# EasyEDA schematic SCH_DRS2_TH_2023-11-22.json
TITLE: Sheet_1; REV: 1.0; Date: 2022-11-13; Sheet: 1/1; Drawn By: MatthiasThiele; Company: Your Company
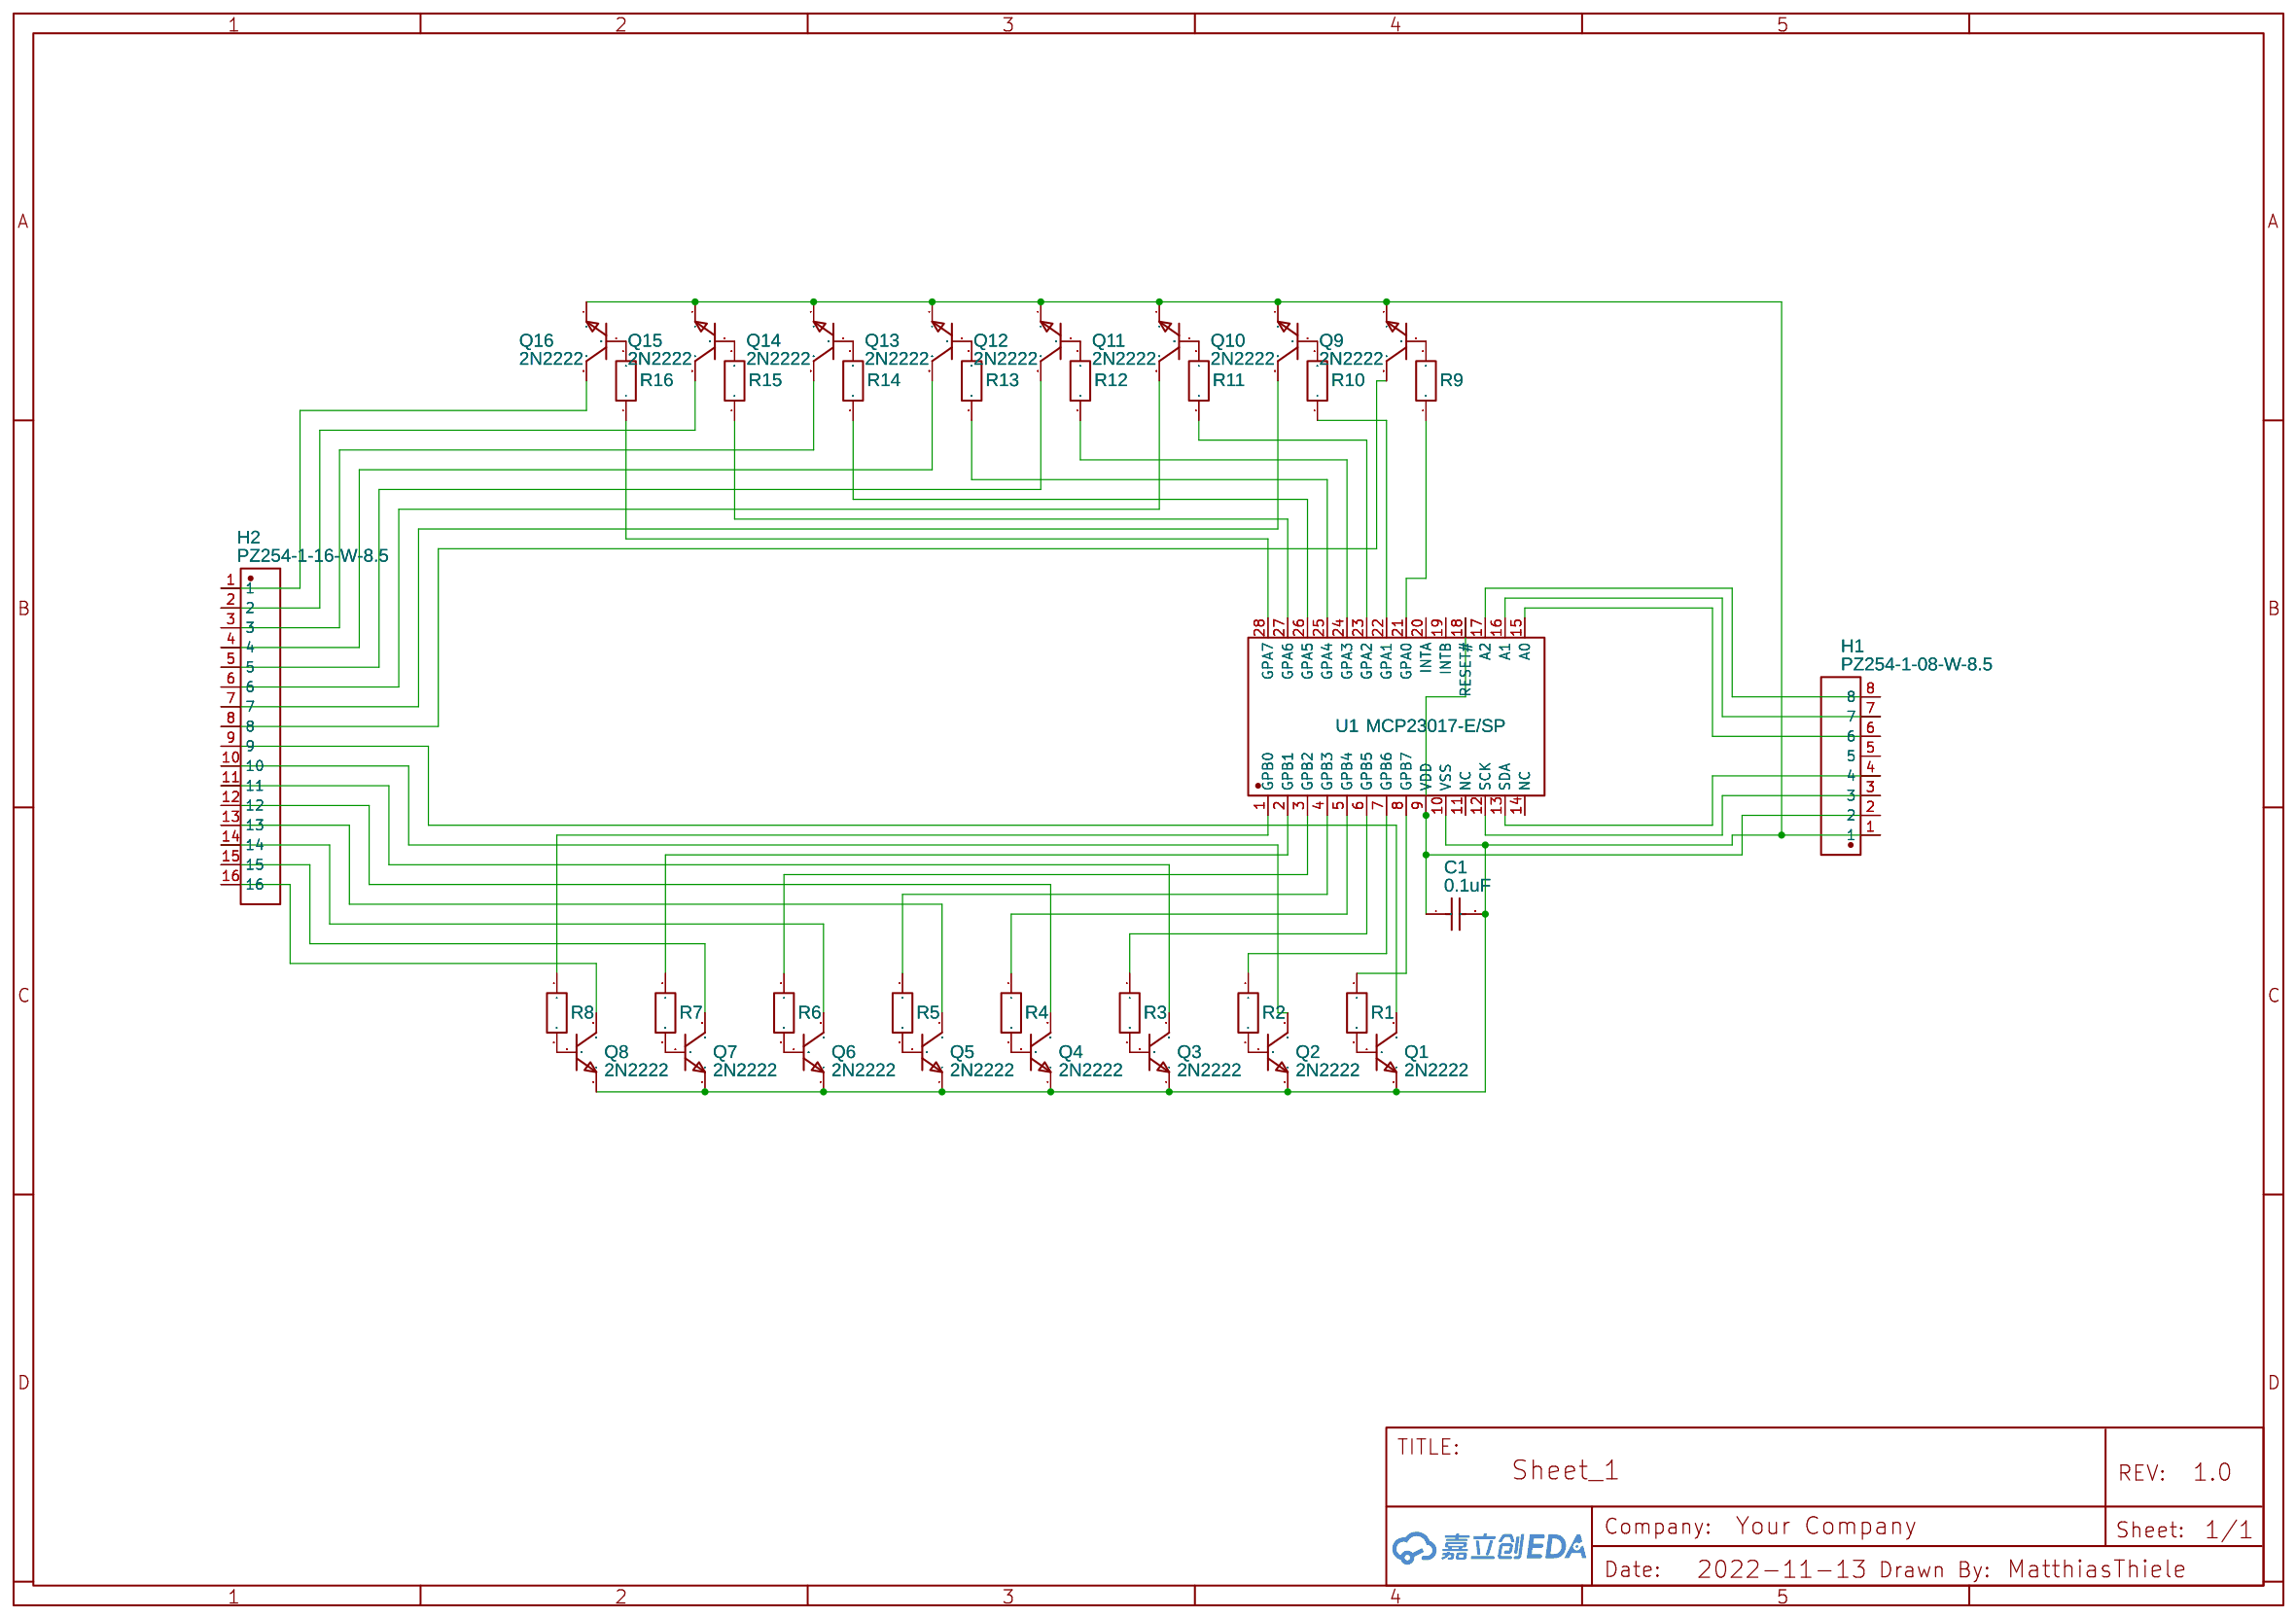
[diagram p0: schematic sheet]

## Parts
C1  0.1uF  [CERAMIC CAPACITOR_100NF]
H1  PZ254-1-08-W-8.5  [HDR-TH_08P-P2.54-H-M-W10.4-N]
H2  PZ254-1-16-W-8.5  [HDR-TH_16P-P2.54-H-M-W10.4-N]
Q1  2N2222  [TO-92-3_L4.9-W3.7-P1.27-L]
Q2  2N2222  [TO-92-3_L4.9-W3.7-P1.27-L]
Q3  2N2222  [TO-92-3_L4.9-W3.7-P1.27-L]
Q4  2N2222  [TO-92-3_L4.9-W3.7-P1.27-L]
Q5  2N2222  [TO-92-3_L4.9-W3.7-P1.27-L]
Q6  2N2222  [TO-92-3_L4.9-W3.7-P1.27-L]
Q7  2N2222  [TO-92-3_L4.9-W3.7-P1.27-L]
Q8  2N2222  [TO-92-3_L4.9-W3.7-P1.27-L]
Q9  2N2222  [TO-92-3_L4.9-W3.7-P1.27-L]
Q10  2N2222  [TO-92-3_L4.9-W3.7-P1.27-L]
Q11  2N2222  [TO-92-3_L4.9-W3.7-P1.27-L]
Q12  2N2222  [TO-92-3_L4.9-W3.7-P1.27-L]
Q13  2N2222  [TO-92-3_L4.9-W3.7-P1.27-L]
Q14  2N2222  [TO-92-3_L4.9-W3.7-P1.27-L]
Q15  2N2222  [TO-92-3_L4.9-W3.7-P1.27-L]
Q16  2N2222  [TO-92-3_L4.9-W3.7-P1.27-L]
R1  1/4W Resistor  [THT 1/4W RESISTOR WITH PINS]
R2  1/4W Resistor  [THT 1/4W RESISTOR WITH PINS]
R3  1/4W Resistor  [THT 1/4W RESISTOR WITH PINS]
R4  1/4W Resistor  [THT 1/4W RESISTOR WITH PINS]
R5  1/4W Resistor  [THT 1/4W RESISTOR WITH PINS]
R6  1/4W Resistor  [THT 1/4W RESISTOR WITH PINS]
R7  1/4W Resistor  [THT 1/4W RESISTOR WITH PINS]
R8  1/4W Resistor  [THT 1/4W RESISTOR WITH PINS]
R9  1/4W Resistor  [THT 1/4W RESISTOR WITH PINS]
R10  1/4W Resistor  [THT 1/4W RESISTOR WITH PINS]
R11  1/4W Resistor  [THT 1/4W RESISTOR WITH PINS]
R12  1/4W Resistor  [THT 1/4W RESISTOR WITH PINS]
R13  1/4W Resistor  [THT 1/4W RESISTOR WITH PINS]
R14  1/4W Resistor  [THT 1/4W RESISTOR WITH PINS]
R15  1/4W Resistor  [THT 1/4W RESISTOR WITH PINS]
R16  1/4W Resistor  [THT 1/4W RESISTOR WITH PINS]
U1  MCP23017-E/SP  [DIP-28_L35.0-W6.5-P2.54-LS7.6-BL]

## Library data of the parts
C1 = CERAMIC CAPACITOR_100nF: Manufacturer Part: Ceramic capacitor0.1UF50V; Contributor: dearali
H1 = PZ254-1-08-W-8.5: Supplier: LCSC; Supplier Part: C2894950; Manufacturer: HCTL(华灿天禄); Contributor: LCSC; JLCPCB Part Class: Extended Part
H2 = PZ254-1-16-W-8.5: Supplier: LCSC; Supplier Part: C2894958; Manufacturer: HCTL(华灿天禄); Contributor: LCSC; JLCPCB Part Class: Extended Part
Q1-Q16 = 2N2222: Supplier: LCSC; Manufacturer: ST(先科); Manufacturer Part: 2N2222A; Contributor: LCSC; Supplier Part: C118536; JLCPCB Part Class: Extended Part
R1-R16 = 11Ω 1/4W Resistor: Contributor: MaMoth 42; Package Display: No
U1 = MCP23017-E/SP: Supplier: LCSC; Supplier Part: C647352; Manufacturer: Microchip Tech; Contributor: LCSC; JLCPCB Part Class: Extended Part

## Nets
Net-(C1-1): C1.1 H1.2 U1.9(VDD) U1.18(RESET#)
Net-(C1-2): C1.2 H1.1 Q1.1(E) Q2.1(E) Q3.1(E) Q4.1(E) Q5.1(E) Q6.1(E) Q7.1(E) Q8.1(E) Q9.1(E) Q10.1(E) Q11.1(E) Q12.1(E) Q13.1(E) Q14.1(E) Q15.1(E) Q16.1(E) U1.10(VSS)
Net-(H1-3): H1.3 U1.12(SCK)
Net-(H1-4): H1.4 U1.13(SDA)
Net-(H1-6): H1.6 U1.15(A0)
Net-(H1-7): H1.7 U1.16(A1)
Net-(H1-8): H1.8 U1.17(A2)
Net-(H2-1): H2.1 Q16.3(C)
Net-(H2-2): H2.2 Q15.3(C)
Net-(H2-3): H2.3 Q14.3(C)
Net-(H2-4): H2.4 Q13.3(C)
Net-(H2-5): H2.5 Q12.3(C)
Net-(H2-6): H2.6 Q11.3(C)
Net-(H2-7): H2.7 Q10.3(C)
Net-(H2-8): H2.8 Q9.3(C)
Net-(H2-9): H2.9 Q1.3(C)
Net-(H2-10): H2.10 Q2.3(C)
Net-(H2-11): H2.11 Q3.3(C)
Net-(H2-12): H2.12 Q4.3(C)
Net-(H2-13): H2.13 Q5.3(C)
Net-(H2-14): H2.14 Q6.3(C)
Net-(H2-15): H2.15 Q7.3(C)
Net-(H2-16): H2.16 Q8.3(C)
Net-(Q1-2): Q1.2(B) R1.2
Net-(Q2-2): Q2.2(B) R2.2
Net-(Q3-2): Q3.2(B) R3.2
Net-(Q4-2): Q4.2(B) R4.2
Net-(Q5-2): Q5.2(B) R5.2
Net-(Q6-2): Q6.2(B) R6.2
Net-(Q7-2): Q7.2(B) R7.2
Net-(Q8-2): Q8.2(B) R8.2
Net-(Q9-2): Q9.2(B) R9.2
Net-(Q10-2): Q10.2(B) R10.2
Net-(Q11-2): Q11.2(B) R11.2
Net-(Q12-2): Q12.2(B) R12.2
Net-(Q13-2): Q13.2(B) R13.2
Net-(Q14-2): Q14.2(B) R14.2
Net-(Q15-2): Q15.2(B) R15.2
Net-(Q16-2): Q16.2(B) R16.2
Net-(R1-1): R1.1 U1.8(GPB7)
Net-(R2-1): R2.1 U1.7(GPB6)
Net-(R3-1): R3.1 U1.6(GPB5)
Net-(R4-1): R4.1 U1.5(GPB4)
Net-(R5-1): R5.1 U1.4(GPB3)
Net-(R6-1): R6.1 U1.3(GPB2)
Net-(R7-1): R7.1 U1.2(GPB1)
Net-(R8-1): R8.1 U1.1(GPB0)
Net-(R9-1): R9.1 U1.21(GPA0)
Net-(R10-1): R10.1 U1.22(GPA1)
Net-(R11-1): R11.1 U1.23(GPA2)
Net-(R12-1): R12.1 U1.24(GPA3)
Net-(R13-1): R13.1 U1.25(GPA4)
Net-(R14-1): R14.1 U1.26(GPA5)
Net-(R15-1): R15.1 U1.27(GPA6)
Net-(R16-1): R16.1 U1.28(GPA7)

Not connected (* = marked no-connect by the designer): H1 5; U1 11(NC) 14(NC) 19(INTB) 20(INTA)
